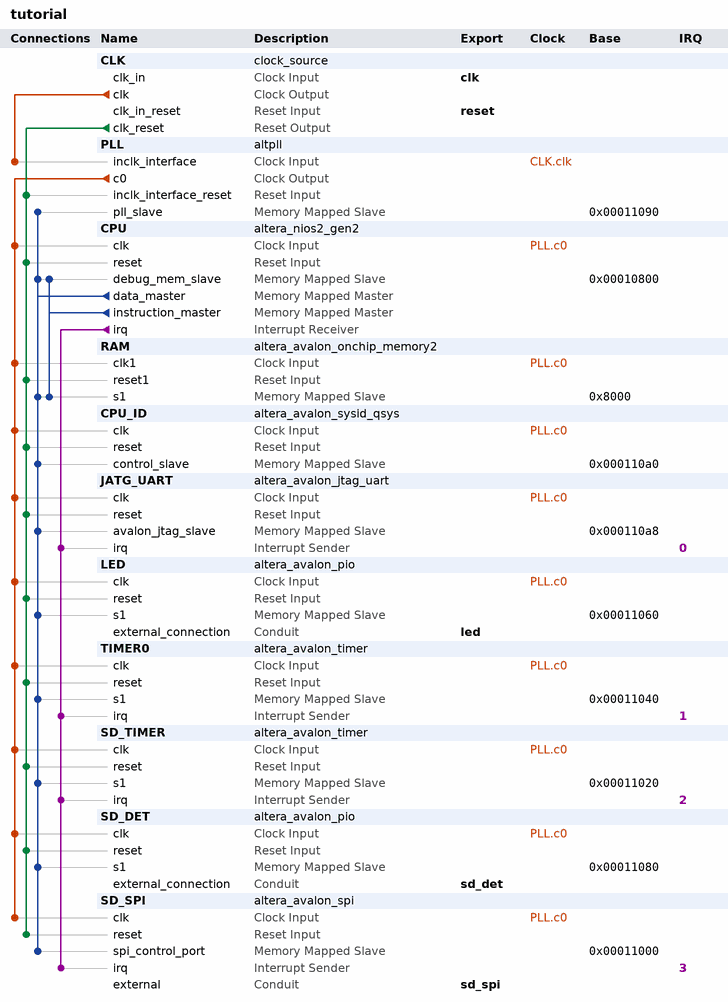
[diagram p0: system contents]
# Platform Designer (Qsys) system tutorial, MAX 10 10M08DAF256C8G
# Parameters at their usual value, and those the tool derives, are not listed.
package require -exact qsys 18.1
create_system tutorial
set_project_property DEVICE_FAMILY {MAX 10}
set_project_property DEVICE 10M08DAF256C8G

add_instance CLK clock_source 18.1
set_instance_parameter_value CLK clockFrequency 10000000

add_instance PLL altpll 18.1
set_instance_parameter_value PLL CLK0_DIVIDE_BY 1
set_instance_parameter_value PLL CLK0_MULTIPLY_BY 5
set_instance_parameter_value PLL INCLK0_INPUT_FREQUENCY 100000
set_instance_parameter_value PLL PORT_ARESET PORT_UNUSED
set_instance_parameter_value PLL PORT_LOCKED PORT_UNUSED
set_instance_parameter_value PLL PORT_clk1 PORT_UNUSED
set_instance_parameter_value PLL PORT_clk2 PORT_UNUSED
set_instance_parameter_value PLL PORT_clk3 PORT_UNUSED

add_instance CPU altera_nios2_gen2 18.1
set_instance_parameter_value CPU dcache_size 2048
set_instance_parameter_value CPU exceptionSlave RAM.s1
set_instance_parameter_value CPU icache_size 4096
set_instance_parameter_value CPU impl Tiny
set_instance_parameter_value CPU resetSlave RAM.s1

add_instance RAM altera_avalon_onchip_memory2 18.1
set_instance_parameter_value RAM dataWidth 32
set_instance_parameter_value RAM dualPort false
set_instance_parameter_value RAM initMemContent false
set_instance_parameter_value RAM initializationFileName onchip_mem.hex
set_instance_parameter_value RAM memorySize 32768

add_instance CPU_ID altera_avalon_sysid_qsys 18.1
set_instance_parameter_value CPU_ID id 0

add_instance JATG_UART altera_avalon_jtag_uart 18.1
set_instance_parameter_value JATG_UART simInteractiveOptions NO_INTERACTIVE_WINDOWS

add_instance LED altera_avalon_pio 18.1
set_instance_parameter_value LED bitModifyingOutReg true
set_instance_parameter_value LED direction Output
set_instance_parameter_value LED resetValue 10
set_instance_parameter_value LED width 4

add_instance TIMER0 altera_avalon_timer 18.1
set_instance_parameter_value TIMER0 period 1
set_instance_parameter_value TIMER0 periodUnits MSEC

add_instance SD_TIMER altera_avalon_timer 18.1
set_instance_parameter_value SD_TIMER alwaysRun true
set_instance_parameter_value SD_TIMER fixedPeriod true
set_instance_parameter_value SD_TIMER period 10
set_instance_parameter_value SD_TIMER periodUnits MSEC
set_instance_parameter_value SD_TIMER snapshot false

add_instance SD_DET altera_avalon_pio 18.1
set_instance_parameter_value SD_DET direction Input
set_instance_parameter_value SD_DET width 2

add_instance SD_SPI altera_avalon_spi 18.1
set_instance_parameter_value SD_SPI clockPolarity 0
set_instance_parameter_value SD_SPI dataWidth 8
set_instance_parameter_value SD_SPI masterSPI true
set_instance_parameter_value SD_SPI numberOfSlaves 1
set_instance_parameter_value SD_SPI targetClockRate 500000

# connections
add_connection CLK.clk PLL.inclk_interface clock
add_connection PLL.c0 CPU.clk clock
add_connection PLL.c0 CPU_ID.clk clock
add_connection PLL.c0 JATG_UART.clk clock
add_connection PLL.c0 LED.clk clock
add_connection PLL.c0 RAM.clk1 clock
add_connection PLL.c0 SD_DET.clk clock
add_connection PLL.c0 SD_SPI.clk clock
add_connection PLL.c0 SD_TIMER.clk clock
add_connection PLL.c0 TIMER0.clk clock
add_connection CLK.clk_reset CPU.reset reset
add_connection CLK.clk_reset CPU_ID.reset reset
add_connection CLK.clk_reset JATG_UART.reset reset
add_connection CLK.clk_reset LED.reset reset
add_connection CLK.clk_reset PLL.inclk_interface_reset reset
add_connection CLK.clk_reset RAM.reset1 reset
add_connection CLK.clk_reset SD_DET.reset reset
add_connection CLK.clk_reset SD_SPI.reset reset
add_connection CLK.clk_reset SD_TIMER.reset reset
add_connection CLK.clk_reset TIMER0.reset reset
add_connection CPU.data_master CPU.debug_mem_slave avalon
set_connection_parameter_value CPU.data_master/CPU.debug_mem_slave baseAddress 0x00010800
add_connection CPU.data_master CPU_ID.control_slave avalon
set_connection_parameter_value CPU.data_master/CPU_ID.control_slave baseAddress 0x000110a0
add_connection CPU.data_master JATG_UART.avalon_jtag_slave avalon
set_connection_parameter_value CPU.data_master/JATG_UART.avalon_jtag_slave baseAddress 0x000110a8
add_connection CPU.data_master LED.s1 avalon
set_connection_parameter_value CPU.data_master/LED.s1 baseAddress 0x00011060
add_connection CPU.data_master PLL.pll_slave avalon
set_connection_parameter_value CPU.data_master/PLL.pll_slave baseAddress 0x00011090
add_connection CPU.data_master RAM.s1 avalon
set_connection_parameter_value CPU.data_master/RAM.s1 baseAddress 0x8000
add_connection CPU.data_master SD_DET.s1 avalon
set_connection_parameter_value CPU.data_master/SD_DET.s1 baseAddress 0x00011080
add_connection CPU.data_master SD_SPI.spi_control_port avalon
set_connection_parameter_value CPU.data_master/SD_SPI.spi_control_port baseAddress 0x00011000
add_connection CPU.data_master SD_TIMER.s1 avalon
set_connection_parameter_value CPU.data_master/SD_TIMER.s1 baseAddress 0x00011020
add_connection CPU.data_master TIMER0.s1 avalon
set_connection_parameter_value CPU.data_master/TIMER0.s1 baseAddress 0x00011040
add_connection CPU.instruction_master CPU.debug_mem_slave avalon
set_connection_parameter_value CPU.instruction_master/CPU.debug_mem_slave baseAddress 0x00010800
add_connection CPU.instruction_master RAM.s1 avalon
set_connection_parameter_value CPU.instruction_master/RAM.s1 baseAddress 0x8000
add_connection CPU.irq JATG_UART.irq interrupt
set_connection_parameter_value CPU.irq/JATG_UART.irq irqNumber 0
add_connection CPU.irq SD_SPI.irq interrupt
set_connection_parameter_value CPU.irq/SD_SPI.irq irqNumber 3
add_connection CPU.irq SD_TIMER.irq interrupt
set_connection_parameter_value CPU.irq/SD_TIMER.irq irqNumber 2
add_connection CPU.irq TIMER0.irq interrupt
set_connection_parameter_value CPU.irq/TIMER0.irq irqNumber 1

# exported interfaces
add_interface clk clock sink
set_interface_property clk EXPORT_OF CLK.clk_in
add_interface led conduit end
set_interface_property led EXPORT_OF LED.external_connection
add_interface reset reset sink
set_interface_property reset EXPORT_OF CLK.clk_in_reset
add_interface sd_det conduit end
set_interface_property sd_det EXPORT_OF SD_DET.external_connection
add_interface sd_spi conduit end
set_interface_property sd_spi EXPORT_OF SD_SPI.external

set_interconnect_requirement {$system} qsys_mm.clockCrossingAdapter HANDSHAKE
set_interconnect_requirement {$system} qsys_mm.enableEccProtection FALSE
set_interconnect_requirement {$system} qsys_mm.insertDefaultSlave FALSE
set_interconnect_requirement {$system} qsys_mm.maxAdditionalLatency 1

save_system tutorial.qsys
